# Altium schematic sheet 06 SPI&SDHC.SchDoc
size 420 x 297 mm
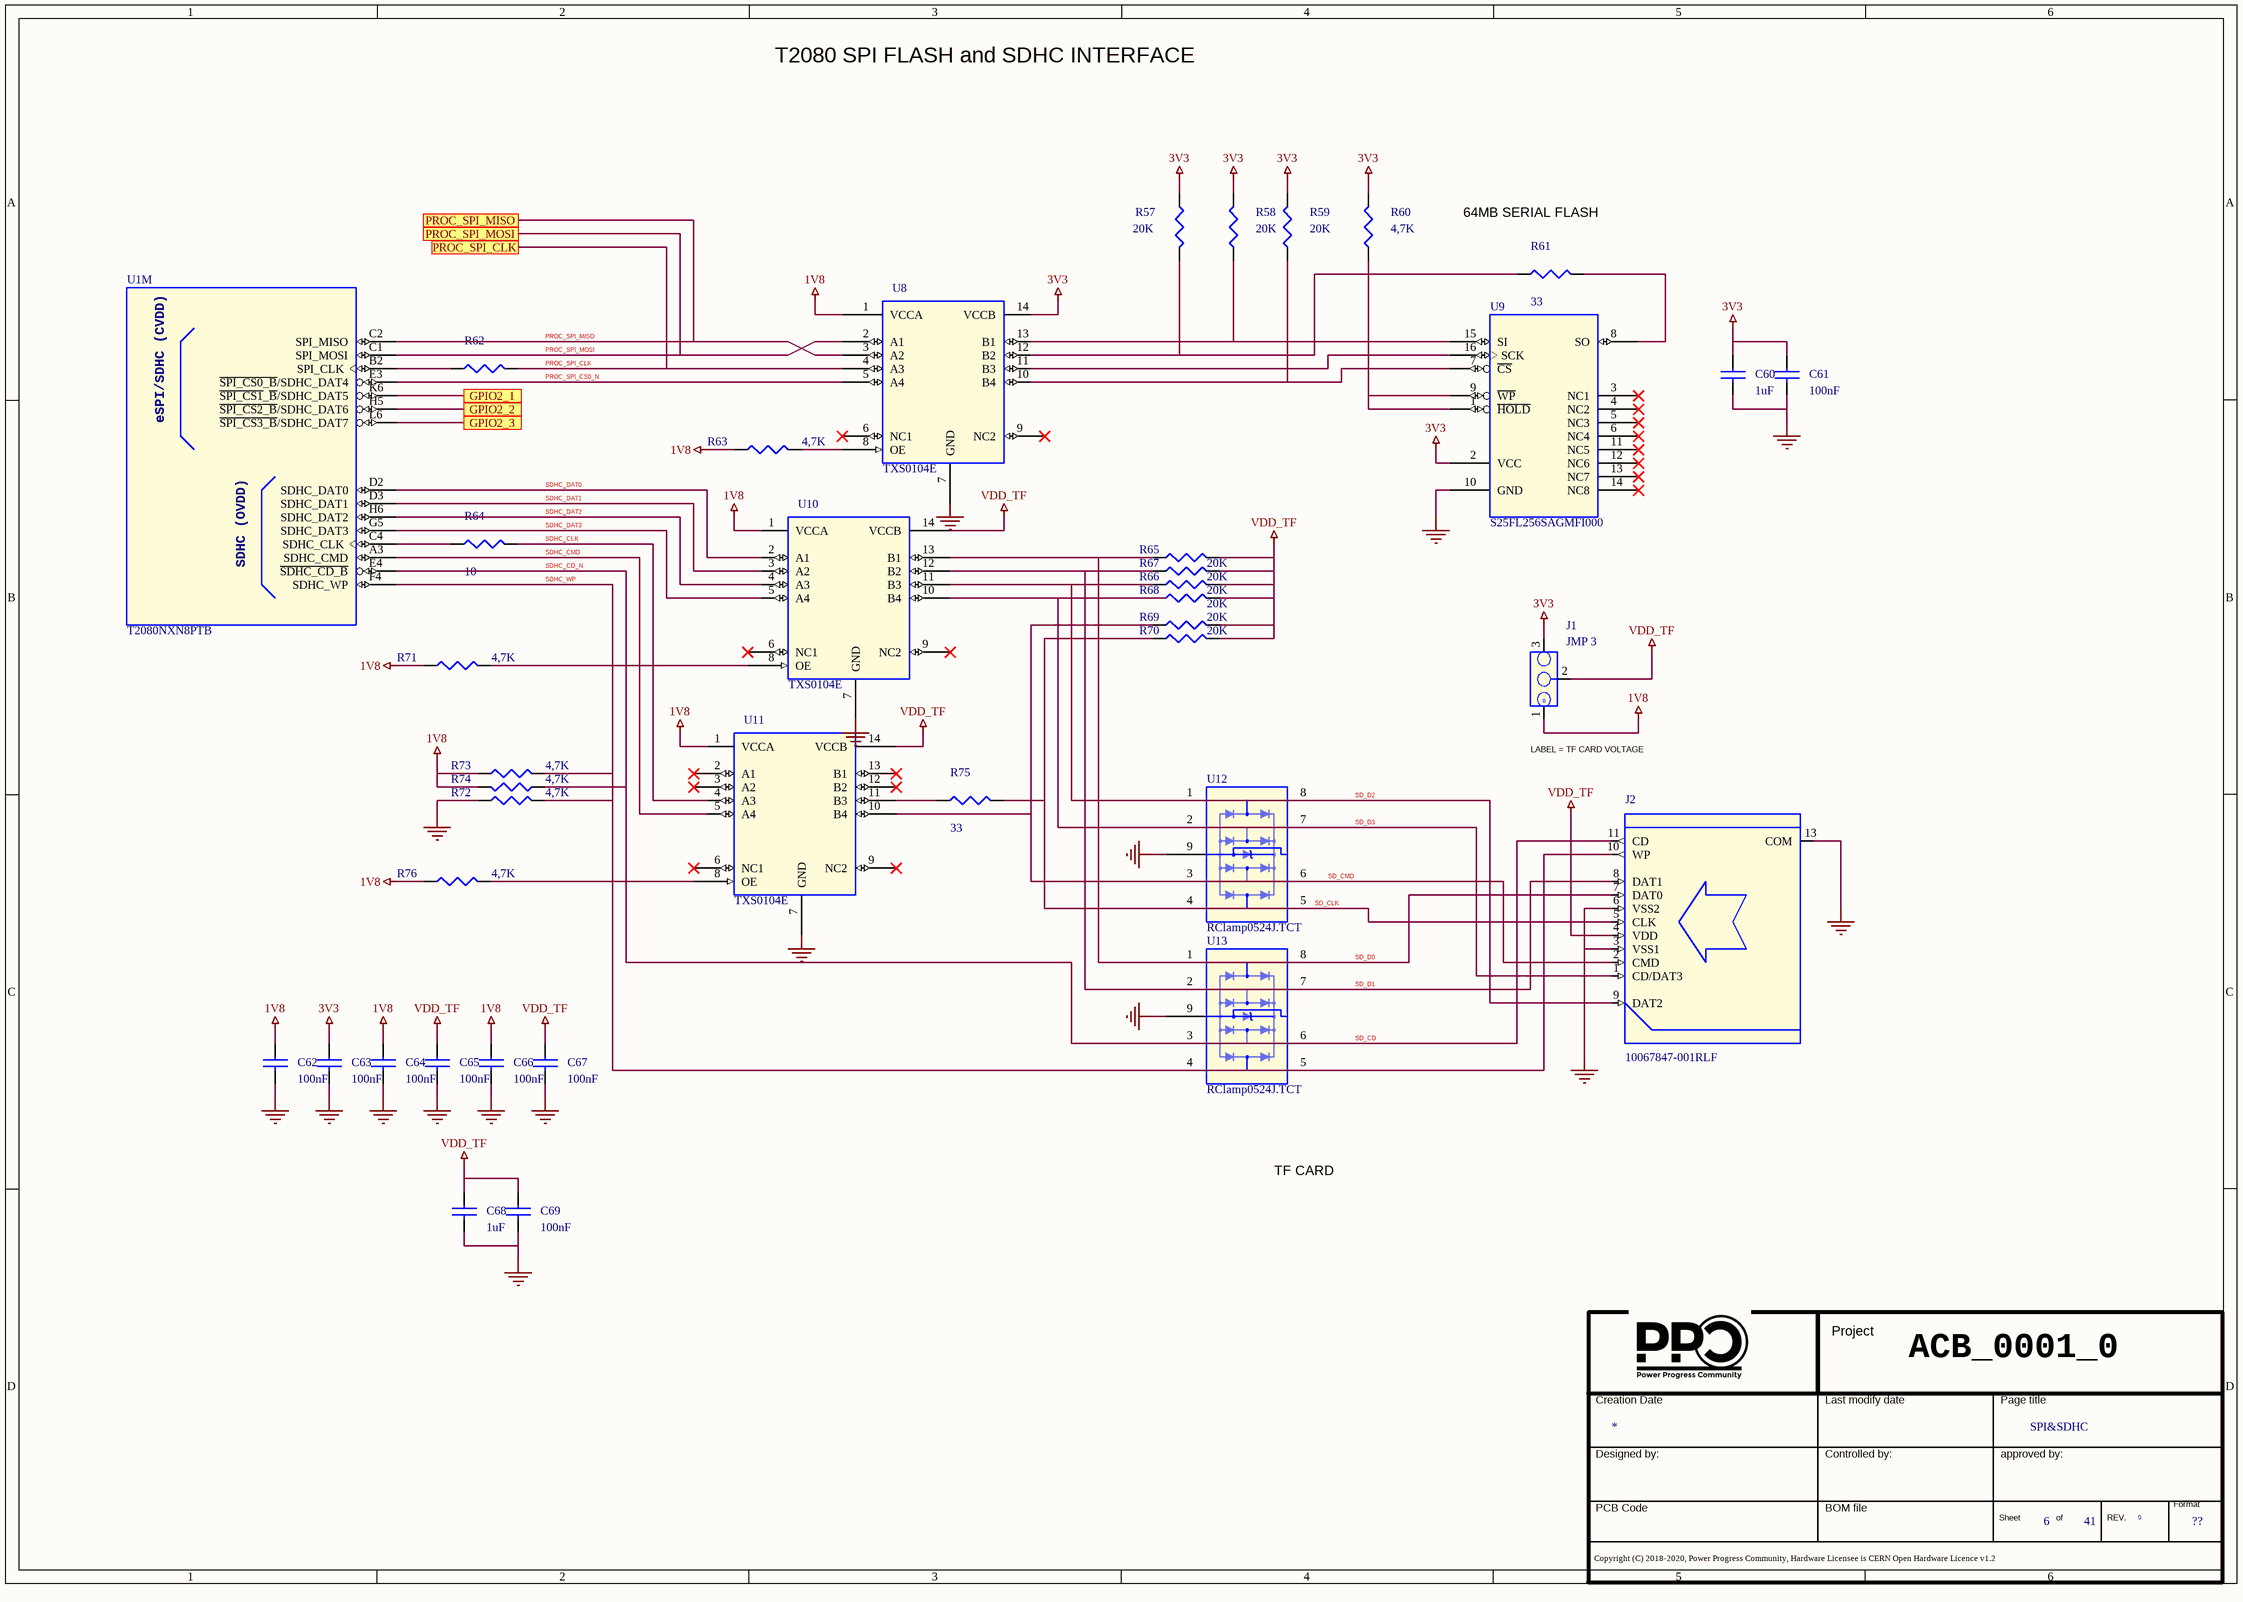
[diagram p0: 06 SPI&SDHC.SchDoc]

## Parts
*  Doc: SPI&SDHC  Page Count: 41  Page Number: 6  Page Size: ??  RevCode: 0  (hidden comment: Title_block_PPC)  (graphical)
C60  1uF  [SMD_0402]
C61  100nF  [SMD_0402]
C62  100nF  [SMD_0402]
C63  100nF  [SMD_0402]
C64  100nF  [SMD_0402]
C65  100nF  [SMD_0402]
C66  100nF  [SMD_0402]
C67  100nF  [SMD_0402]
C68  1uF  [SMD_0402]
C69  100nF  [SMD_0402]
J1  JMP 3  [PTH]
J2  10067847-001RLF  [SMD]
R57  20K  [SMD_0402]
R58  20K  [SMD_0402]
R59  20K  [SMD_0402]
R60  4,7K  [SMD_0402]
R61  33  [SMD_0402]
R62  10  [SMD_0402]
R63  4,7K  [SMD_0402]
R64  10  [SMD_0402]
R65  20K  [SMD_0402]
R66  20K  [SMD_0402]
R67  20K  [SMD_0402]
R68  20K  [SMD_0402]
R69  20K  [SMD_0402]
R70  20K  [SMD_0402]
R71  4,7K  [SMD_0402]
R72  4,7K  [SMD_0402]
R73  4,7K  [SMD_0402]
R74  4,7K  [SMD_0402]
R75  33  [SMD_0402]
R76  4,7K  [SMD_0402]
U1  T2080NXN8PTB  [bga]  (part M of 14)
U8  TXS0104E  [TSSOP14]
U9  S25FL256SAGMFI000  [so_16l]
U10  TXS0104E  [TSSOP14]
U11  TXS0104E  [TSSOP14]
U12  RClamp0524J.TCT  [tvs_slp2710p8]
U13  RClamp0524J.TCT  [tvs_slp2710p8]

## Ports
GPIO2_1, GPIO2_2, GPIO2_3, PROC_SPI_CLK, PROC_SPI_MISO, PROC_SPI_MOSI

## Nets
1V8: C62.1 C64.1 C66.1 J1.1 R63.1 R71.1 R73.1 R74.2 R76.1 U8.1(VCCA) U10.1(VCCA) U11.1(VCCA)
3V3: C60.1 C61.1 C63.1 J1.3 R57.2 R58.2 R59.2 R60.2 U8.14(VCCB) U9.2(VCC)
GND: C60.2 C61.2 C62.2 C63.2 C64.2 C65.2 C66.2 C67.2 C68.2 C69.2 J2.3(VSS1) J2.6(VSS2) J2.13(COM) R72.1 U8.7(GND) U9.10(GND) U10.7(GND) U11.7(GND) U12.9 U13.9
VDD_TF: C65.1 C67.1 C68.1 C69.1 J1.2 J2.4(VDD) R65.2 R66.2 R67.2 R68.2 R69.2 R70.2 U10.14(VCCB) U11.14(VCCB)
GPIO2_1: U1.K6(~{SPI_CS1}_~{B}/SDHC_DAT5) ; port GPIO2_1
GPIO2_2: U1.H5(~{SPI_CS2_B}/SDHC_DAT6) ; port GPIO2_2
GPIO2_3: U1.L6(~{SPI_CS3_B}/SDHC_DAT7) ; port GPIO2_3
PROC_SPI_CLK: R62.2 U8.4(A3) ; port PROC_SPI_CLK
PROC_SPI_CS0_N: U1.E3(~{SPI_CS0_B}/SDHC_DAT4) U8.5(A4)
PROC_SPI_MISO: U1.C2(SPI_MISO) U8.3(A2) ; port PROC_SPI_MISO
PROC_SPI_MOSI: U1.C1(SPI_MOSI) U8.2(A1) ; port PROC_SPI_MOSI
SD_CD: J2.11(CD) R74.1 U1.E4(~{SDHC_CD_B}) U13.3 U13.6  [also labelled SDHC_CD_N]
SD_CLK: J2.5(CLK) R70.1 R75.2 U12.4 U12.5
SD_CMD: J2.2(CMD) R69.1 U11.10(B4) U12.3 U12.6
SD_D0: J2.7(DAT0) R65.1 U10.13(B1) U13.1 U13.8
SD_D1: J2.8(DAT1) R67.1 U10.12(B2) U13.2 U13.7
SD_D2: J2.9(DAT2) R66.1 U10.11(B3) U12.1 U12.8
SD_D3: J2.1(CD/DAT3) R68.1 U10.10(B4) U12.2 U12.7
SDHC_CLK: R64.2 U11.4(A3)
SDHC_CMD: U1.A3(SDHC_CMD) U11.5(A4)
SDHC_DAT0: U1.D2(SDHC_DAT0) U10.2(A1)
SDHC_DAT1: U1.D3(SDHC_DAT1) U10.3(A2)
SDHC_DAT2: U1.H6(SDHC_DAT2) U10.4(A3)
SDHC_DAT3: U1.G5(SDHC_DAT3) U10.5(A4)
SDHC_WP: J2.10(WP) R72.2 R73.2 U1.F4(SDHC_WP) U13.4 U13.5
NetR57_1: R57.1 R61.1 U8.12(B2)
NetR58_1: R58.1 U8.13(B1) U9.15(SI)
NetR59_1: R59.1 U8.10(B4) U9.7(~{CS})
NetR60_1: R60.1 U9.1(~{HOLD}) U9.9(~{WP})
NetR61_2: R61.2 U9.8(SO)
NetR62_1: R62.1 U1.B2(SPI_CLK)
NetR63_2: R63.2 U8.8(OE)
NetR64_1: R64.1 U1.C4(SDHC_CLK)
NetR71_2: R71.2 U10.8(OE)
NetR75_1: R75.1 U11.11(B3)
NetR76_2: R76.2 U11.8(OE)
NetU8_11: U8.11(B3) U9.16(SCK)

Not connected (* = marked no-connect by the designer): U8 6(NC1)* 9(NC2)*; U9 3(NC1)* 4(NC2)* 5(NC3)* 6(NC4)* 11(NC5)* 12(NC6)* 13(NC7)* 14(NC8)*; U10 6(NC1)* 9(NC2)*; U11 2(A1)* 3(A2)* 6(NC1)* 9(NC2)* 12(B2)* 13(B1)*

## Notes on the sheet
- T2080 SPI FLASH and SDHC INTERFACE
- (near R61) 64MB SERIAL FLASH
- (near J1) LABEL = TF CARD VOLTAGE
- TF CARD
- ACB_0001_0
- (in symbol T2080, part M) eSPI/SDHC (CVDD); SDHC (OVDD)
- (in symbol Title_block_PPC) Project; Creation Date; Last modify date; Page title; Designed by:; Controlled by:; approved by:; Format; PCB Code; BOM file; Sheet; of; REV.; Copyright (C) 2018-2020, Power Progress Community, Hardware Licensee is CERN Open Hardware Licence v1.2

## Library data of the parts
* = Title_block_PPC: Title: T2080PCIe; Schematic Page Count: 45; Schematic Page Number: 7; Author: MICETEK; Page Create Date: March  8, 1995; Page Title: ?; Page Modify Date: *
C60 = CAP NP_Dup2: CAP CER 1UF 25V X6S 0402; Part Number: PASSIVE_1446; Manufacturer 1: Murata; Manufacturer Part Number 1: GRM155C81E105KE11D; RSM: RC0402; Part Type: Capacitors\Ceramic\SMD\0402; PCB Footprint: SMD_0402
C61 = CAP NP_Dup2: COND.CER. 100NF 50V 0402 X7R SMD; Manufacturer Part Number 1: CGA2B3X7R1H104M050BD; Manufacturer 1: TDK; Part Number: PASSIVE_24; RSM: RC0402; PCB Footprint: SMD_0402; Part Type: Capacitors\Ceramic\SMD\0402
C62-C67 C69 = CAP NP_Dup2: COND.CER. 100NF 50V 0402 X7R SMD; Part Number: PASSIVE_24; Manufacturer 1: TDK; Manufacturer Part Number 1: CGA2B3X7R1H104M050BD; RSM: RC0402; Part Type: Capacitors\Ceramic\SMD\0402; PCB Footprint: SMD_0402
C68 = CAP NP_Dup2: CAP CER 1UF 25V X6S 0402; Manufacturer Part Number 1: GRM155C81E105KE11D; Manufacturer 1: Murata; Part Number: PASSIVE_1446; RSM: RC0402; Part Type: Capacitors\Ceramic\SMD\0402; PCB Footprint: SMD_0402
J1 = JUMPER_3: STRIP MASC.1x3P CS.p=2 mm; Manufacturer Part Number 1: 951103-8622-AR; Manufacturer 1: 3M; Part Number: CONNECTORS_446; RSM: PIN-2MM-3; Distributor 1: DIGIKEY(3M9322-ND); Part Type: Strip\Terminal; PCB Footprint: PTH
J2 = SD Card Socket_FCI: CONN SD CARD PUSH-PUSH SMD; Manufacturer 1: FCI; Part Number: CONNECTORS_688; RSM: FCI-SD_CARD-10067847; Distributor 1: DIGIKEY (609-3956-1-ND); Manufacturer Part Number 1: 10067847-001RLF; Part Type: SOCKET\SD; PCB Footprint: SMD
R57 R59 R65-R68 R70 = R_Dup5: RESIS.CHIP 20K 1% 0402 SMD; Manufacturer Part Number 1: RC0402FR-1320KL; Manufacturer 1: YAGEO; Part Number: PASSIVE_641; RSM: RC0402; Part Type: Resistors\Fixed\SMD\0402\1%; PCB Footprint: SMD_0402
R58 R69 = R_Dup5: RESIS.CHIP 20K 1% 0402 SMD; Part Number: PASSIVE_641; Manufacturer 1: YAGEO; Manufacturer Part Number 1: RC0402FR-1320KL; RSM: RC0402; Part Type: Resistors\Fixed\SMD\0402\1%; PCB Footprint: SMD_0402
R60 R71-R74 = R_Dup5: RESIS.CHIP 4,7K 5% 0402 SMD; Manufacturer 1: ROYAL OHM; Part Number: PASSIVE_861; RSM: RC0402; Manufacturer Part Number 1: RESIS.CHIP 4,7K 5% 0402 SMD; Part Type: Resistors\Fixed\SMD\0402\5%; PCB Footprint: SMD_0402
R61 R75 = R_Dup5: RESIS.CHIP 33R 5% 0402 SMD; Manufacturer 1: ROYAL OHM; Part Number: PASSIVE_853; RSM: RC0402; Manufacturer Part Number 1: RESIS.CHIP 33R 5% 0402 SMD; Part Type: Resistors\Fixed\SMD\0402\5%; PCB Footprint: SMD_0402
R62 R64 = R_Dup5: RESIS.CHIP 10R 5% 0402 SMD; Manufacturer 1: ROYAL OHM; Part Number: PASSIVE_811; RSM: RC0402; PCB Footprint: SMD_0402; Manufacturer Part Number 1: RESIS.CHIP 10R 5% 0402 SMD; Part Type: Resistors\Fixed\SMD\0402\5%
R63 R76 = R_Dup5: RESIS.CHIP 4,7K 5% 0402 SMD; Part Number: PASSIVE_861; Manufacturer 1: ROYAL OHM; RSM: RC0402; PCB Footprint: SMD_0402; Part Type: Resistors\Fixed\SMD\0402\5%; Manufacturer Part Number 1: RESIS.CHIP 4,7K 5% 0402 SMD
U1 = T2080: QRIQ MPU 1.87GT/s DDR3/3L 4x10GE; Manufacturer 1: NXP; Part Number: MICROPROCESSOR_65; PCB Footprint: BGA896; Vendor: Freescale; RSM: PBGA896-0_8MM-26X25; Distributor 1: MOUSER(841-T2080NXN8PTB); Manufacturer Part Number 1: T2080NXN8PTB; Part Type: 32 BIT; MPN: T2080; TYPE: IC
U8 = TXS0104E: BIDIRECTIONAL VOLTAGE-LEVEL TRANSLATOR; Manufacturer Part Number 1: TXS0104EPWR; Manufacturer 1: TEXAS; Part Number: LOGIC_264; RSM: TSSOP-14; PCB Footprint: TSSOP14; Distributor 1: TI.COM; Part Type: TRANSLATOR
U9 = FLASH-SERIAL-SO16: IC FLASH 256M SPI 133MHZ 16SOIC; Manufacturer 1: CYPRESS; Part Number: MEMORIES_102; MPN: N25Q512A13GSF40F; PCB Footprint: SOIC_16; Vendor: Micron; RSM: SO-16; Distributor 1: DIGIKEY(1274-1003-ND); Manufacturer Part Number 1: S25FL256SAGMFI000; Part Type: FLASH; TYPE: IC
U10 U11 = TXS0104E: BIDIRECTIONAL VOLTAGE-LEVEL TRANSLATOR; Part Number: LOGIC_264; Manufacturer 1: TEXAS; Manufacturer Part Number 1: TXS0104EPWR; RSM: TSSOP-14; PCB Footprint: TSSOP14; Part Type: TRANSLATOR; Distributor 1: TI.COM
U12 U13 = RClamp0524J: TVS DIODE 5V 15V SLP2710P8; Part Number: DISCRETE_321; Manufacturer 1: Semtec; Vendor: Sentech; PCB Footprint: 10-UFDFN; MPN: RClamp0524J.TCT; TYPE: IC; Part Type: Protections; Manufacturer Part Number 1: RClamp0524J.TCT; Distributor 1: DIGIKEY(RCLAMP0524JCT-ND); RSM: SLP2710